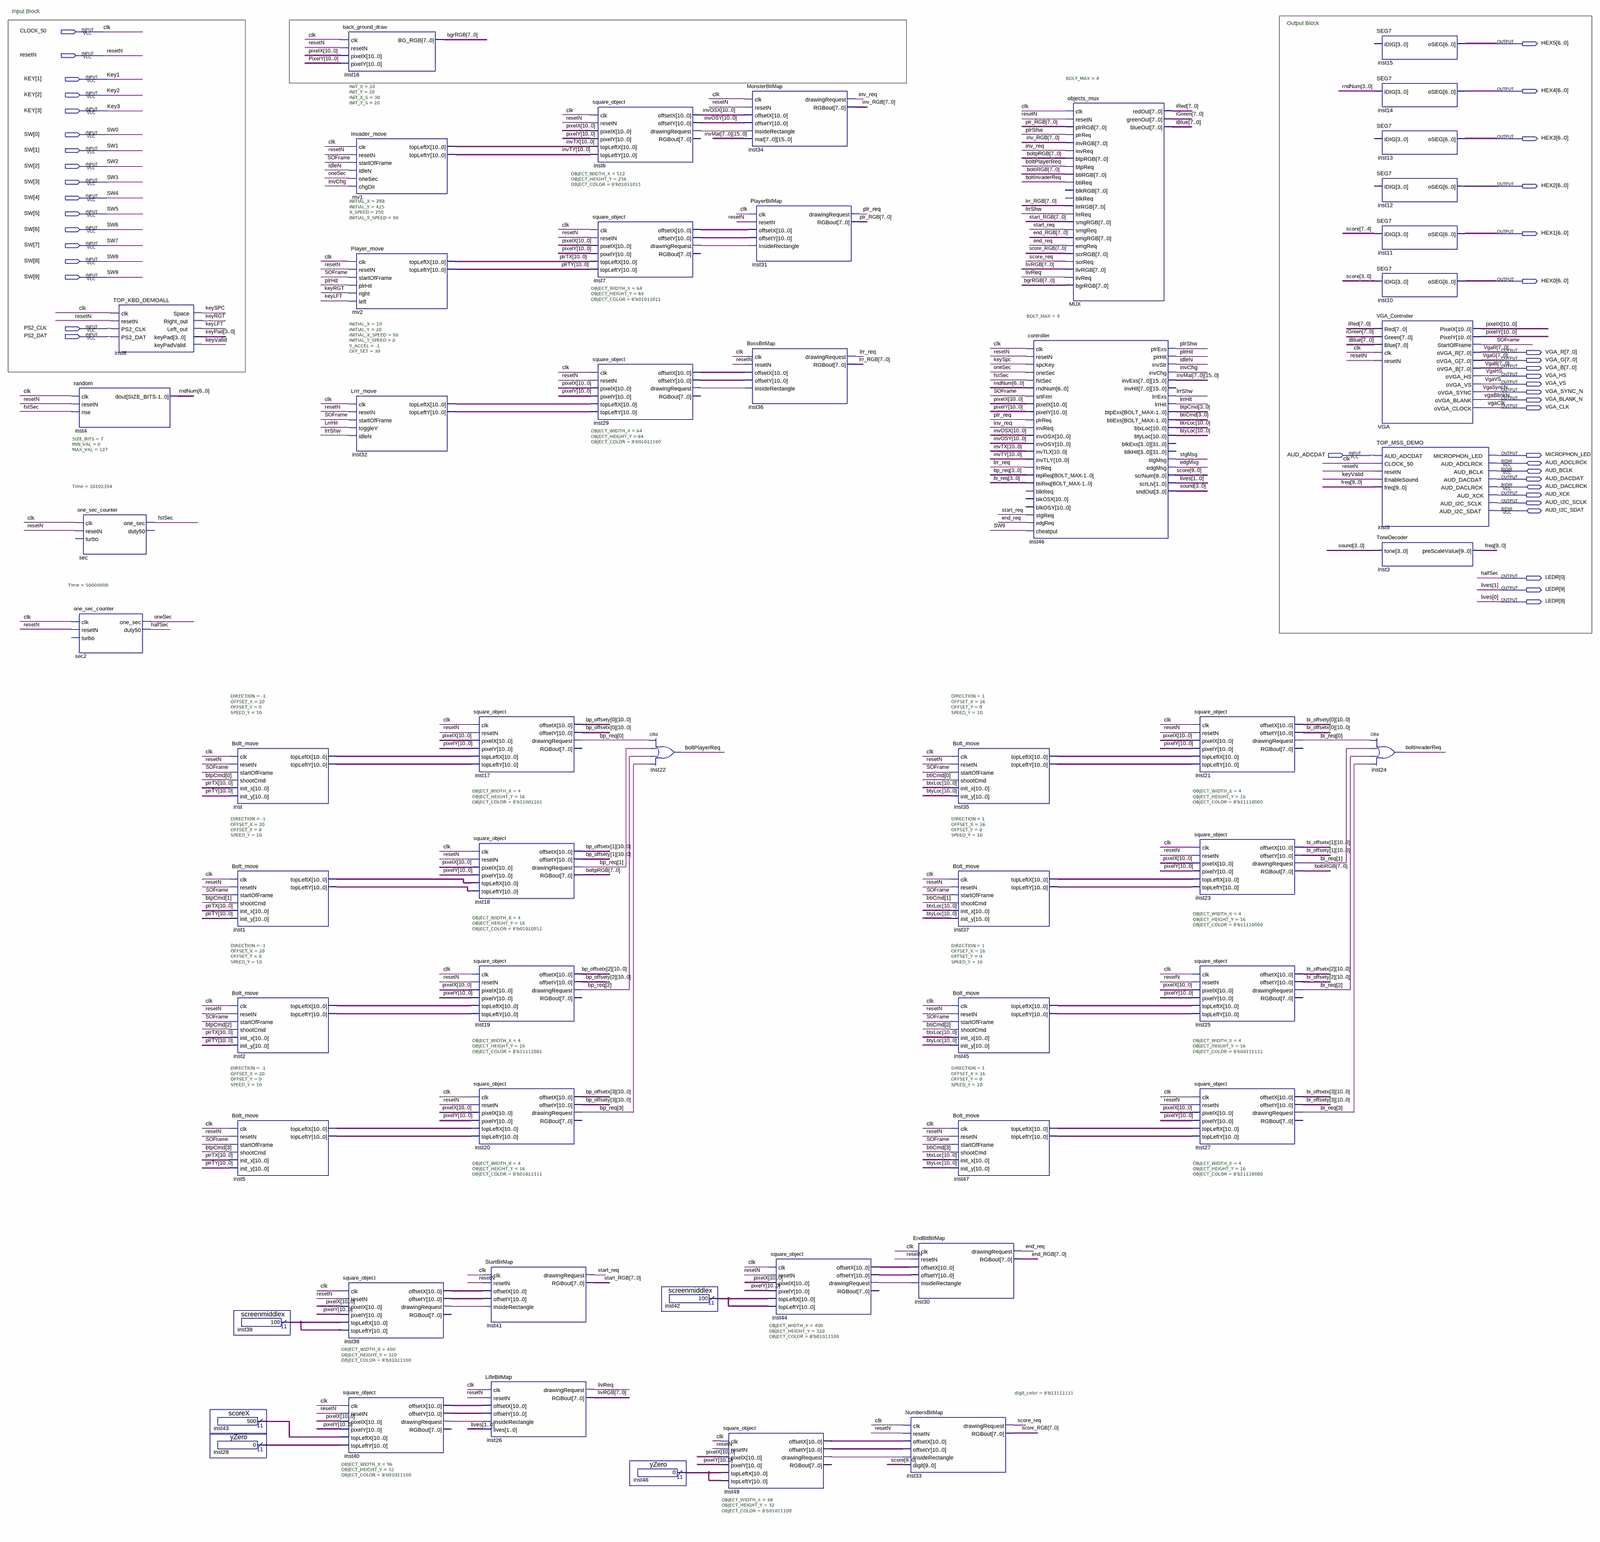
[diagram p0: schematic sheet, whole]
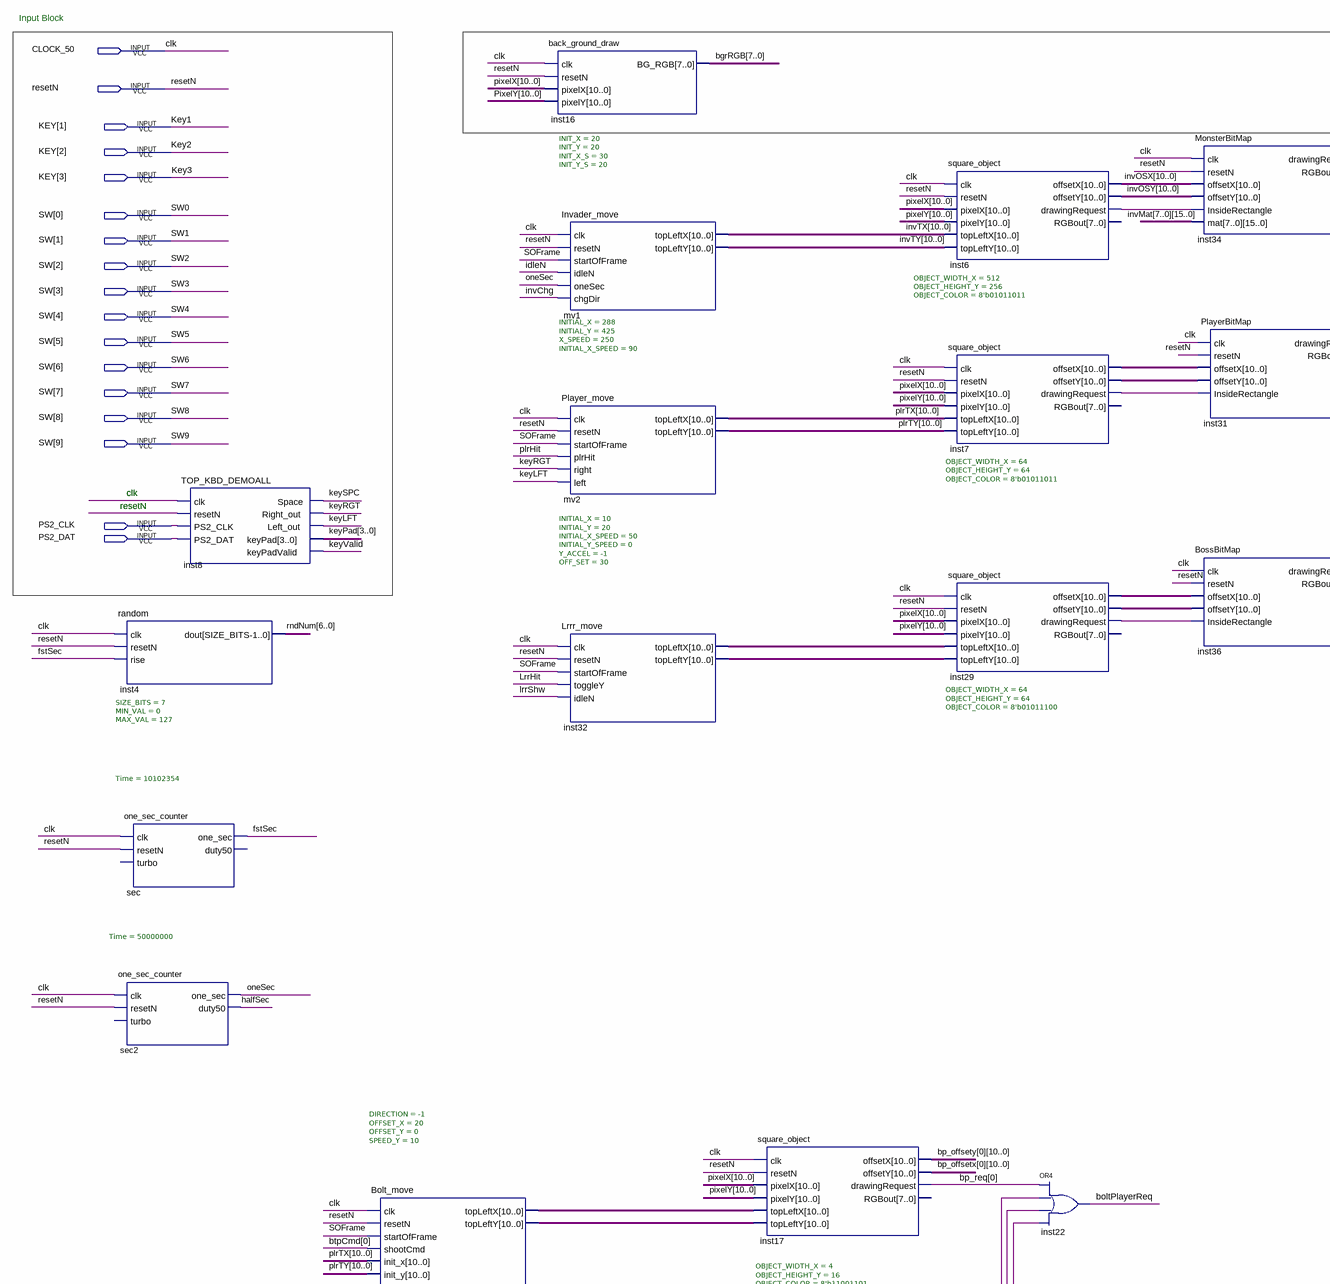
[diagram p1: schematic sheet, upper left part]
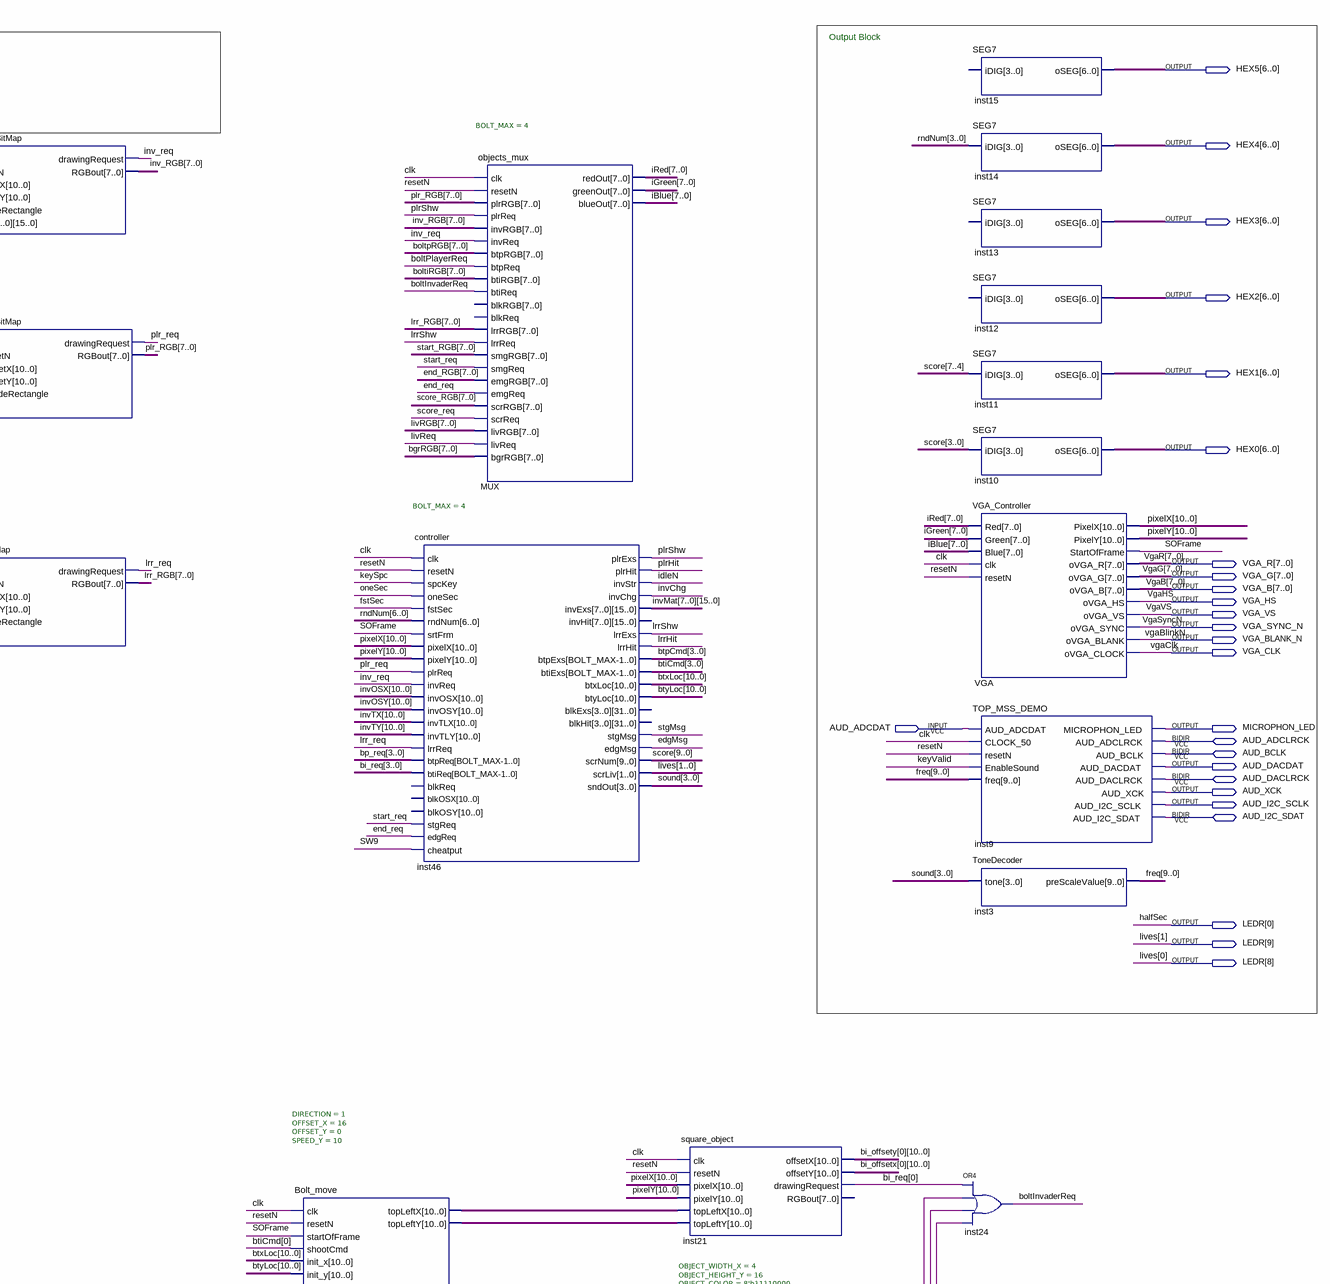
[diagram p2: schematic sheet, upper right part]
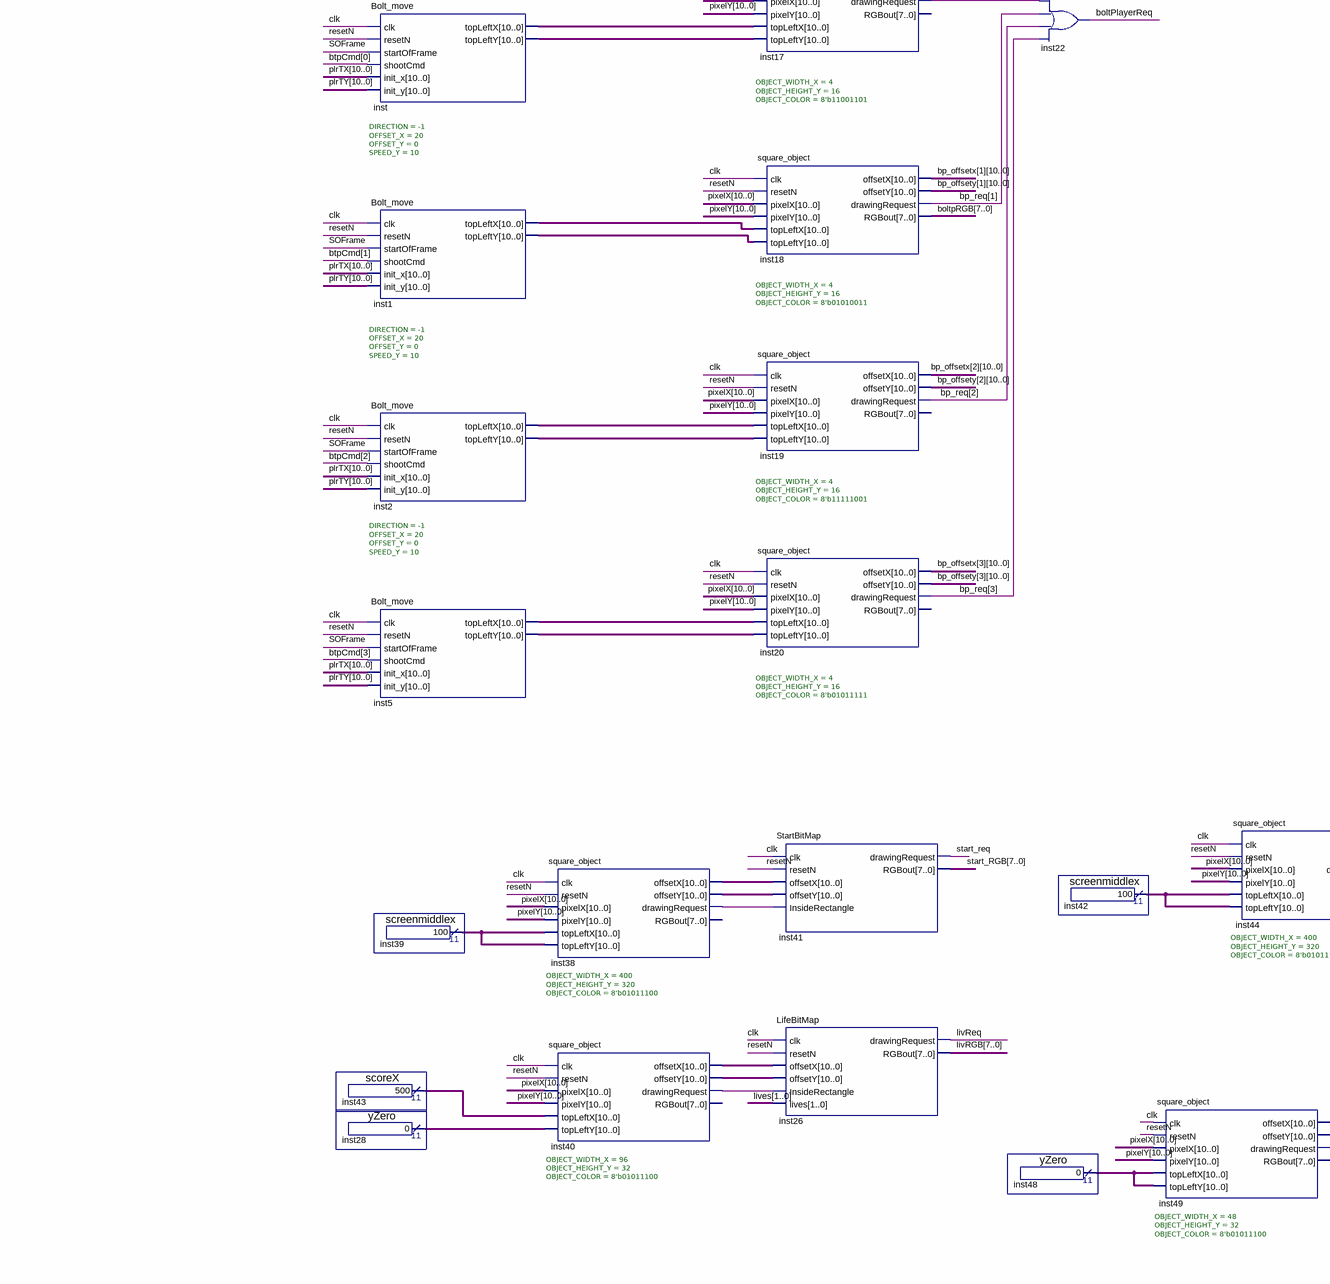
[diagram p3: schematic sheet, lower left part]
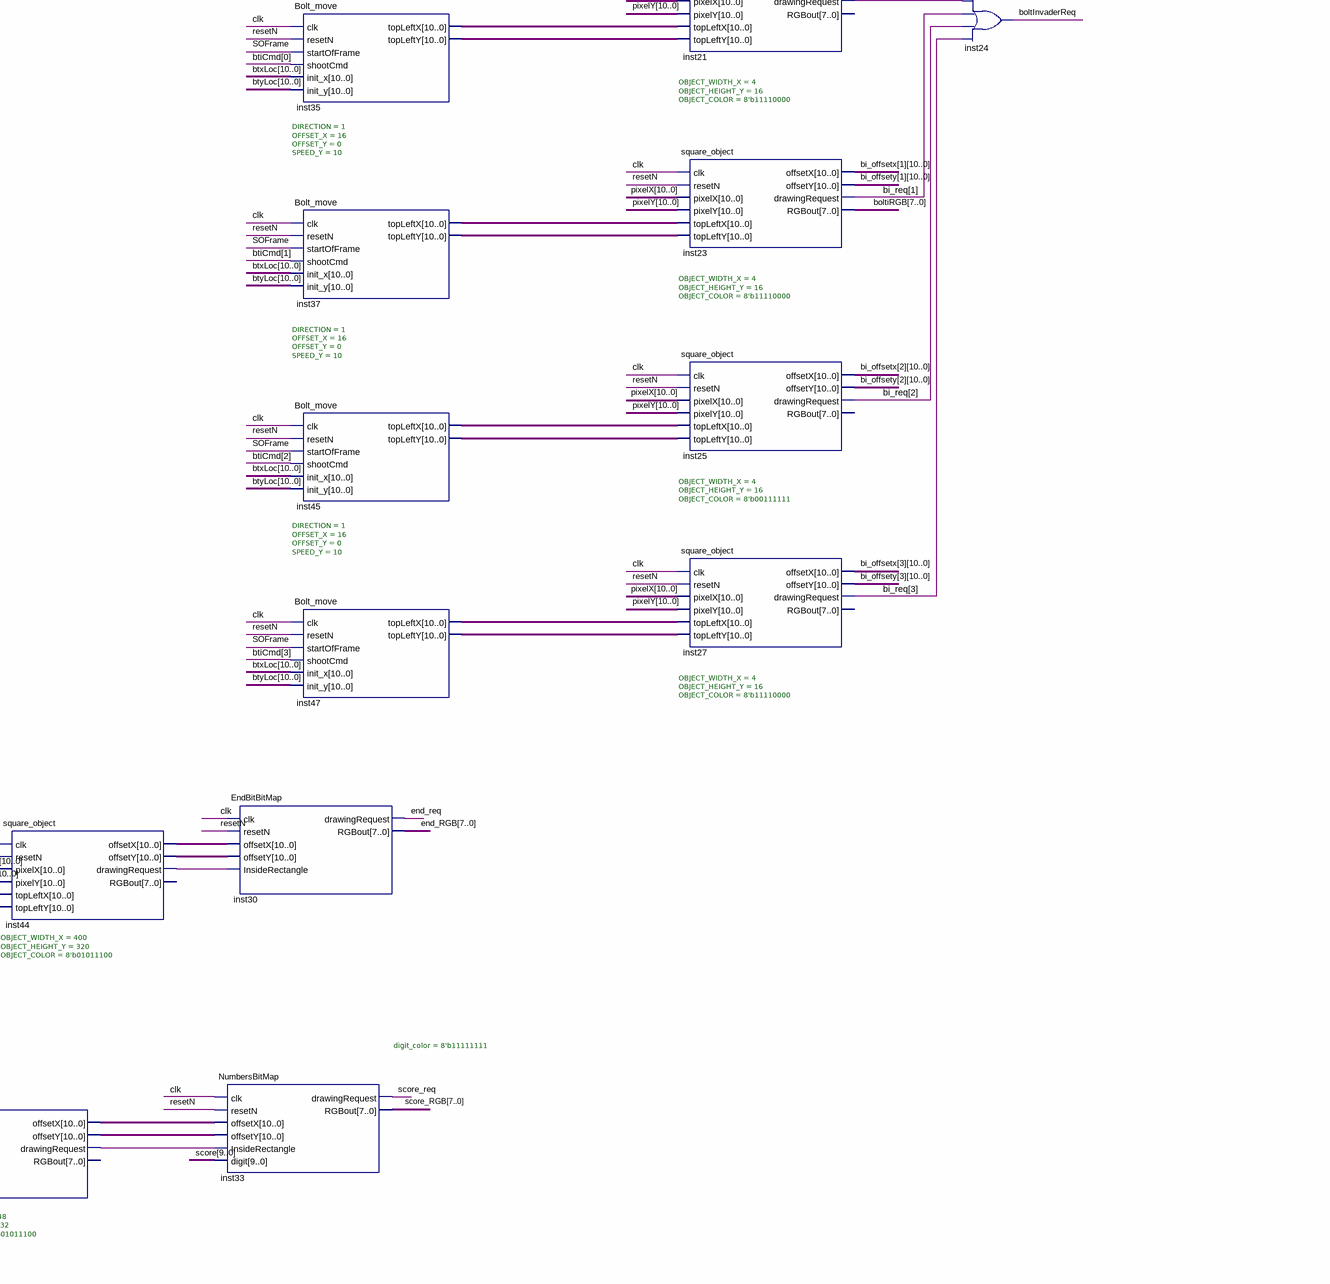
[diagram p4: schematic sheet, lower right part]
// Quartus schematic TOP_Schematic.bdf as structural Verilog: 56 symbols, 43 pins
module TOP_Schematic (
  input  CLOCK_50,
  input  resetN,
  input  [3:1] KEY,
  input  [9:0] SW,
  input  PS2_CLK,
  input  PS2_DAT,
  input  AUD_ADCDAT,
  inout  AUD_ADCLRCK,
  inout  AUD_BCLK,
  inout  AUD_DACLRCK,
  inout  AUD_I2C_SDAT,
  output [6:0] HEX5,
  output [6:0] HEX4,
  output [6:0] HEX3,
  output [6:0] HEX2,
  output [6:0] HEX1,
  output [6:0] HEX0,
  output [7:0] VGA_R,
  output [7:0] VGA_G,
  output [7:0] VGA_B,
  output VGA_HS,
  output VGA_VS,
  output VGA_SYNC_N,
  output VGA_BLANK_N,
  output VGA_CLK,
  output MICROPHON_LED,
  output AUD_DACDAT,
  output AUD_XCK,
  output AUD_I2C_SCLK,
  output [9:0] LEDR
);

  wire boltInvaderReq, boltPlayerReq, edgMsg, end_req, fstSec, idleN, inst6_drawingrequest,
       inst7_drawingrequest, inst29_drawingrequest, inst38_drawingrequest, inst40_drawingrequest,
       inst44_drawingrequest, inst49_drawingrequest, inv_req, invChg, keyLFT, keyRGT, keySPC, keyValid,
       livReq, lrr_req, lrrHit, lrrShw, oneSec, plr_req, plrHit, plrShw, score_req, SOFrame, start_req,
       stgMsg;
  wire [3:0] bi_req, bp_req, btiCmd, btpCmd, keyPad, sound;
  wire [6:0] rndNum;
  wire [7:0] bgrRGB, boltiRGB, boltpRGB, end_RGB, iBlue, iGreen, inv_RGB, iRed, livRGB, lrr_RGB, plr_RGB,
       score_RGB, start_RGB;
  wire [9:0] freq, score;
  wire [10:0] bi_offsetx_0, bi_offsetx_1, bi_offsetx_2, bi_offsetx_3, bi_offsety_0, bi_offsety_1,
       bi_offsety_2, bi_offsety_3, bp_offsetx_0, bp_offsetx_1, bp_offsetx_2, bp_offsetx_3, bp_offsety_0,
       bp_offsety_1, bp_offsety_2, bp_offsety_3, btxLoc, btyLoc, inst1_topleftx, inst1_toplefty,
       inst2_topleftx, inst2_toplefty, inst5_topleftx, inst5_toplefty, inst7_offsetx, inst7_offsety,
       inst28_result, inst29_offsetx, inst29_offsety, inst32_topleftx, inst32_toplefty, inst35_topleftx,
       inst35_toplefty, inst37_topleftx, inst37_toplefty, inst38_offsetx, inst38_offsety, inst39_result,
       inst40_offsetx, inst40_offsety, inst42_result, inst43_result, inst44_offsetx, inst44_offsety,
       inst45_topleftx, inst45_toplefty, inst47_topleftx, inst47_toplefty, inst48_result, inst49_offsetx,
       inst49_offsety, inst_topleftx, inst_toplefty, invOSX, invOSY, invTX, invTY, pixelX, PixelY, plrTX,
       plrTY;
  wire [15:0] invMat_0, invMat_1, invMat_2, invMat_3, invMat_4, invMat_5, invMat_6, invMat_7;

  random #(.SIZE_BITS(7), .MIN_VAL(0), .MAX_VAL(127)) inst4 (
    .clk(CLOCK_50), .resetN(resetN), .rise(fstSec), .dout(rndNum));
  one_sec_counter #(.Time(10102354)) sec (.clk(CLOCK_50), .resetN(resetN), .one_sec(fstSec));  // open: turbo, duty50
  one_sec_counter #(.Time(50000000)) sec2 (
    .clk(CLOCK_50), .resetN(resetN), .one_sec(oneSec), .duty50(LEDR[0]));  // open: turbo
  TOP_KBD_DEMOALL inst8 (
    .clk(CLOCK_50), .resetN(resetN), .PS2_CLK(PS2_CLK), .PS2_DAT(PS2_DAT), .Space(keySPC),
    .Right_out(keyRGT), .Left_out(keyLFT), .keyPad(keyPad), .keyPadValid(keyValid));
  Bolt_move #(.DIRECTION(-1), .OFFSET_X(20), .OFFSET_Y(0), .SPEED_Y(10)) inst (
    .clk(CLOCK_50), .resetN(resetN), .startOfFrame(SOFrame), .shootCmd(btpCmd[0]), .init_x(plrTX),
    .init_y(plrTY), .topLeftX(inst_topleftx), .topLeftY(inst_toplefty));
  Bolt_move #(.DIRECTION(-1), .OFFSET_X(20), .OFFSET_Y(0), .SPEED_Y(10)) inst1 (
    .clk(CLOCK_50), .resetN(resetN), .startOfFrame(SOFrame), .shootCmd(btpCmd[1]), .init_x(plrTX),
    .init_y(plrTY), .topLeftX(inst1_topleftx), .topLeftY(inst1_toplefty));
  Bolt_move #(.DIRECTION(-1), .OFFSET_X(20), .OFFSET_Y(0), .SPEED_Y(10)) inst2 (
    .clk(CLOCK_50), .resetN(resetN), .startOfFrame(SOFrame), .shootCmd(btpCmd[2]), .init_x(plrTX),
    .init_y(plrTY), .topLeftX(inst2_topleftx), .topLeftY(inst2_toplefty));
  Bolt_move #(.DIRECTION(-1), .OFFSET_X(20), .OFFSET_Y(0), .SPEED_Y(10)) inst5 (
    .clk(CLOCK_50), .resetN(resetN), .startOfFrame(SOFrame), .shootCmd(btpCmd[3]), .init_x(plrTX),
    .init_y(plrTY), .topLeftX(inst5_topleftx), .topLeftY(inst5_toplefty));
  screenmiddlex inst39 (.result(inst39_result));
  scoreX inst43 (.result(inst43_result));
  yZero inst28 (.result(inst28_result));
  back_ground_draw inst16 (.clk(CLOCK_50), .resetN(resetN), .pixelX(pixelX), .pixelY(PixelY), .BG_RGB(bgrRGB));
  Invader_move #(.INIT_X(20), .INIT_Y(20), .INIT_X_S(30), .INIT_Y_S(20)) mv1 (
    .clk(CLOCK_50), .resetN(resetN), .startOfFrame(SOFrame), .idleN(idleN), .oneSec(oneSec), .chgDir(invChg),
    .topLeftX(invTX), .topLeftY(invTY));
  Player_move #(.INITIAL_X(288), .INITIAL_Y(425), .X_SPEED(250), .INITIAL_X_SPEED(90)) mv2 (
    .clk(CLOCK_50), .resetN(resetN), .startOfFrame(SOFrame), .plrHit(plrHit), .right(keyRGT), .left(keyLFT),
    .topLeftX(plrTX), .topLeftY(plrTY));
  Lrrr_move #(.INITIAL_X(10), .INITIAL_Y(20), .INITIAL_X_SPEED(50), .INITIAL_Y_SPEED(0), .Y_ACCEL(-1), .OFF_SET(30)) inst32 (
    .clk(CLOCK_50), .resetN(resetN), .startOfFrame(SOFrame), .toggleY(lrrHit), .idleN(lrrShw),
    .topLeftX(inst32_topleftx), .topLeftY(inst32_toplefty));
  square_object #(.OBJECT_WIDTH_X(400), .OBJECT_HEIGHT_Y(320), .OBJECT_COLOR(8'b01011100)) inst38 (
    .clk(CLOCK_50), .resetN(resetN), .pixelX(pixelX), .pixelY(PixelY), .topLeftX(inst39_result),
    .topLeftY(inst39_result), .offsetX(inst38_offsetx), .offsetY(inst38_offsety),
    .drawingRequest(inst38_drawingrequest));  // open: RGBout
  square_object #(.OBJECT_WIDTH_X(96), .OBJECT_HEIGHT_Y(32), .OBJECT_COLOR(8'b01011100)) inst40 (
    .clk(CLOCK_50), .resetN(resetN), .pixelX(pixelX), .pixelY(PixelY), .topLeftX(inst43_result),
    .topLeftY(inst28_result), .offsetX(inst40_offsetx), .offsetY(inst40_offsety),
    .drawingRequest(inst40_drawingrequest));  // open: RGBout
  square_object #(.OBJECT_WIDTH_X(4), .OBJECT_HEIGHT_Y(16), .OBJECT_COLOR(8'b11001101)) inst17 (
    .clk(CLOCK_50), .resetN(resetN), .pixelX(pixelX), .pixelY(PixelY), .topLeftX(inst_topleftx),
    .topLeftY(inst_toplefty), .offsetX(bp_offsety_0), .offsetY(bp_offsetx_0), .drawingRequest(bp_req[0]));  // open: RGBout
  square_object #(.OBJECT_WIDTH_X(4), .OBJECT_HEIGHT_Y(16), .OBJECT_COLOR(8'b01010011)) inst18 (
    .clk(CLOCK_50), .resetN(resetN), .pixelX(pixelX), .pixelY(PixelY), .topLeftX(inst1_topleftx),
    .topLeftY(inst1_toplefty), .offsetX(bp_offsetx_1), .offsetY(bp_offsety_1), .drawingRequest(bp_req[1]),
    .RGBout(boltpRGB));
  square_object #(.OBJECT_WIDTH_X(4), .OBJECT_HEIGHT_Y(16), .OBJECT_COLOR(8'b11111001)) inst19 (
    .clk(CLOCK_50), .resetN(resetN), .pixelX(pixelX), .pixelY(PixelY), .topLeftX(inst2_topleftx),
    .topLeftY(inst2_toplefty), .offsetX(bp_offsetx_2), .offsetY(bp_offsety_2), .drawingRequest(bp_req[2]));  // open: RGBout
  square_object #(.OBJECT_WIDTH_X(4), .OBJECT_HEIGHT_Y(16), .OBJECT_COLOR(8'b01011111)) inst20 (
    .clk(CLOCK_50), .resetN(resetN), .pixelX(pixelX), .pixelY(PixelY), .topLeftX(inst5_topleftx),
    .topLeftY(inst5_toplefty), .offsetX(bp_offsetx_3), .offsetY(bp_offsety_3), .drawingRequest(bp_req[3]));  // open: RGBout
  StartBitMap inst41 (
    .clk(CLOCK_50), .resetN(resetN), .offsetX(inst38_offsetx), .offsetY(inst38_offsety),
    .InsideRectangle(inst38_drawingrequest), .drawingRequest(start_req), .RGBout(start_RGB));
  LifeBitMap inst26 (
    .clk(CLOCK_50), .resetN(resetN), .offsetX(inst40_offsetx), .offsetY(inst40_offsety),
    .InsideRectangle(inst40_drawingrequest), .lives(LEDR[9:8]), .drawingRequest(livReq), .RGBout(livRGB));
  square_object #(.OBJECT_WIDTH_X(512), .OBJECT_HEIGHT_Y(256), .OBJECT_COLOR(8'b01011011)) inst6 (
    .clk(CLOCK_50), .resetN(resetN), .pixelX(pixelX), .pixelY(PixelY), .topLeftX(invTX), .topLeftY(invTY),
    .offsetX(invOSX), .offsetY(invOSY), .drawingRequest(inst6_drawingrequest));  // open: RGBout
  square_object #(.OBJECT_WIDTH_X(64), .OBJECT_HEIGHT_Y(64), .OBJECT_COLOR(8'b01011011)) inst7 (
    .clk(CLOCK_50), .resetN(resetN), .pixelX(pixelX), .pixelY(PixelY), .topLeftX(plrTX), .topLeftY(plrTY),
    .offsetX(inst7_offsetx), .offsetY(inst7_offsety), .drawingRequest(inst7_drawingrequest));  // open: RGBout
  square_object #(.OBJECT_WIDTH_X(64), .OBJECT_HEIGHT_Y(64), .OBJECT_COLOR(8'b01011100)) inst29 (
    .clk(CLOCK_50), .resetN(resetN), .pixelX(pixelX), .pixelY(PixelY), .topLeftX(inst32_topleftx),
    .topLeftY(inst32_toplefty), .offsetX(inst29_offsetx), .offsetY(inst29_offsety),
    .drawingRequest(inst29_drawingrequest));  // open: RGBout
  yZero inst48 (.result(inst48_result));
  or inst22 (boltPlayerReq, bp_req[0], bp_req[1], bp_req[2], bp_req[3]);
  screenmiddlex inst42 (.result(inst42_result));
  square_object #(.OBJECT_WIDTH_X(48), .OBJECT_HEIGHT_Y(32), .OBJECT_COLOR(8'b01011100)) inst49 (
    .clk(CLOCK_50), .resetN(resetN), .pixelX(pixelX), .pixelY(PixelY), .topLeftX(inst48_result),
    .topLeftY(inst48_result), .offsetX(inst49_offsetx), .offsetY(inst49_offsety),
    .drawingRequest(inst49_drawingrequest));  // open: RGBout
  MonsterBitMap inst34 (
    .clk(CLOCK_50), .resetN(resetN), .offsetX(invOSX), .offsetY(invOSY),
    .InsideRectangle(inst6_drawingrequest),
    .mat({invMat_7, invMat_6, invMat_5, invMat_4, invMat_3, invMat_2, invMat_1, invMat_0}),
    .drawingRequest(inv_req), .RGBout(inv_RGB));
  PlayerBitMap inst31 (
    .clk(CLOCK_50), .resetN(resetN), .offsetX(inst7_offsetx), .offsetY(inst7_offsety),
    .InsideRectangle(inst7_drawingrequest), .drawingRequest(plr_req), .RGBout(plr_RGB));
  BossBitMap inst36 (
    .clk(CLOCK_50), .resetN(resetN), .offsetX(inst29_offsetx), .offsetY(inst29_offsety),
    .InsideRectangle(inst29_drawingrequest), .drawingRequest(lrr_req), .RGBout(lrr_RGB));
  square_object #(.OBJECT_WIDTH_X(400), .OBJECT_HEIGHT_Y(320), .OBJECT_COLOR(8'b01011100)) inst44 (
    .clk(CLOCK_50), .resetN(resetN), .pixelX(pixelX), .pixelY(PixelY), .topLeftX(inst42_result),
    .topLeftY(inst42_result), .offsetX(inst44_offsetx), .offsetY(inst44_offsety),
    .drawingRequest(inst44_drawingrequest));  // open: RGBout
  EndBitBitMap inst30 (
    .clk(CLOCK_50), .resetN(resetN), .offsetX(inst44_offsetx), .offsetY(inst44_offsety),
    .InsideRectangle(inst44_drawingrequest), .drawingRequest(end_req), .RGBout(end_RGB));
  NumbersBitMap #(.digit_color(8'b11111111)) inst33 (
    .clk(CLOCK_50), .resetN(resetN), .offsetX(inst49_offsetx), .offsetY(inst49_offsety),
    .InsideRectangle(inst49_drawingrequest), .digit(score), .drawingRequest(score_req), .RGBout(score_RGB));
  Bolt_move #(.DIRECTION(1), .OFFSET_X(16), .OFFSET_Y(0), .SPEED_Y(10)) inst35 (
    .clk(CLOCK_50), .resetN(resetN), .startOfFrame(SOFrame), .shootCmd(btiCmd[0]), .init_x(btxLoc),
    .init_y(btyLoc), .topLeftX(inst35_topleftx), .topLeftY(inst35_toplefty));
  Bolt_move #(.DIRECTION(1), .OFFSET_X(16), .OFFSET_Y(0), .SPEED_Y(10)) inst37 (
    .clk(CLOCK_50), .resetN(resetN), .startOfFrame(SOFrame), .shootCmd(btiCmd[1]), .init_x(btxLoc),
    .init_y(btyLoc), .topLeftX(inst37_topleftx), .topLeftY(inst37_toplefty));
  Bolt_move #(.DIRECTION(1), .OFFSET_X(16), .OFFSET_Y(0), .SPEED_Y(10)) inst45 (
    .clk(CLOCK_50), .resetN(resetN), .startOfFrame(SOFrame), .shootCmd(btiCmd[2]), .init_x(btxLoc),
    .init_y(btyLoc), .topLeftX(inst45_topleftx), .topLeftY(inst45_toplefty));
  Bolt_move #(.DIRECTION(1), .OFFSET_X(16), .OFFSET_Y(0), .SPEED_Y(10)) inst47 (
    .clk(CLOCK_50), .resetN(resetN), .startOfFrame(SOFrame), .shootCmd(btiCmd[3]), .init_x(btxLoc),
    .init_y(btyLoc), .topLeftX(inst47_topleftx), .topLeftY(inst47_toplefty));
  controller #(.BOLT_MAX(4)) inst46 (
    .clk(CLOCK_50), .resetN(resetN), .spcKey(keySPC), .oneSec(oneSec), .fstSec(fstSec), .rndNum(rndNum),
    .srtFrm(SOFrame), .pixelX(pixelX), .pixelY(PixelY), .plrReq(plr_req), .invReq(inv_req), .invOSX(invOSX),
    .invOSY(invOSY), .invTLX(invTX), .invTLY(invTY), .lrrReq(lrr_req), .btpReq(bp_req), .btiReq(bi_req),
    .stgReq(start_req), .edgReq(end_req), .cheatput(SW[9]), .plrExs(plrShw), .plrHit(plrHit), .invStr(idleN),
    .invChg(invChg),
    .invExs({invMat_7, invMat_6, invMat_5, invMat_4, invMat_3, invMat_2, invMat_1, invMat_0}),
    .lrrExs(lrrShw), .lrrHit(lrrHit), .btpExs(btpCmd), .btiExs(btiCmd), .btxLoc(btxLoc), .btyLoc(btyLoc),
    .stgMsg(stgMsg), .edgMsg(edgMsg), .scrNum(score), .scrLiv(LEDR[9:8]), .sndOut(sound));  // open: blkReq, blkOSX, blkOSY, invHit, blkExs, blkHit
  objects_mux #(.BOLT_MAX(4)) MUX (
    .clk(CLOCK_50), .resetN(resetN), .plrRGB(plr_RGB), .plrReq(plrShw), .invRGB(inv_RGB), .invReq(inv_req),
    .btpRGB(boltpRGB), .btpReq(boltPlayerReq), .btiRGB(boltiRGB), .btiReq(boltInvaderReq), .lrrRGB(lrr_RGB),
    .lrrReq(lrrShw), .smgRGB(start_RGB), .smgReq(start_req), .emgRGB(end_RGB), .emgReq(end_req),
    .scrRGB(score_RGB), .scrReq(score_req), .livRGB(livRGB), .livReq(livReq), .bgrRGB(bgrRGB), .redOut(iRed),
    .greenOut(iGreen), .blueOut(iBlue));  // open: blkRGB, blkReq
  square_object #(.OBJECT_WIDTH_X(4), .OBJECT_HEIGHT_Y(16), .OBJECT_COLOR(8'b11110000)) inst21 (
    .clk(CLOCK_50), .resetN(resetN), .pixelX(pixelX), .pixelY(PixelY), .topLeftX(inst35_topleftx),
    .topLeftY(inst35_toplefty), .offsetX(bi_offsety_0), .offsetY(bi_offsetx_0), .drawingRequest(bi_req[0]));  // open: RGBout
  square_object #(.OBJECT_WIDTH_X(4), .OBJECT_HEIGHT_Y(16), .OBJECT_COLOR(8'b11110000)) inst23 (
    .clk(CLOCK_50), .resetN(resetN), .pixelX(pixelX), .pixelY(PixelY), .topLeftX(inst37_topleftx),
    .topLeftY(inst37_toplefty), .offsetX(bi_offsetx_1), .offsetY(bi_offsety_1), .drawingRequest(bi_req[1]),
    .RGBout(boltiRGB));
  square_object #(.OBJECT_WIDTH_X(4), .OBJECT_HEIGHT_Y(16), .OBJECT_COLOR(8'b00111111)) inst25 (
    .clk(CLOCK_50), .resetN(resetN), .pixelX(pixelX), .pixelY(PixelY), .topLeftX(inst45_topleftx),
    .topLeftY(inst45_toplefty), .offsetX(bi_offsetx_2), .offsetY(bi_offsety_2), .drawingRequest(bi_req[2]));  // open: RGBout
  square_object #(.OBJECT_WIDTH_X(4), .OBJECT_HEIGHT_Y(16), .OBJECT_COLOR(8'b11110000)) inst27 (
    .clk(CLOCK_50), .resetN(resetN), .pixelX(pixelX), .pixelY(PixelY), .topLeftX(inst47_topleftx),
    .topLeftY(inst47_toplefty), .offsetX(bi_offsetx_3), .offsetY(bi_offsety_3), .drawingRequest(bi_req[3]));  // open: RGBout
  SEG7 inst15 (.oSEG(HEX5));  // open: iDIG
  SEG7 inst14 (.iDIG(rndNum[3:0]), .oSEG(HEX4));
  SEG7 inst13 (.oSEG(HEX3));  // open: iDIG
  SEG7 inst12 (.oSEG(HEX2));  // open: iDIG
  SEG7 inst11 (.iDIG(score[7:4]), .oSEG(HEX1));
  SEG7 inst10 (.iDIG(score[3:0]), .oSEG(HEX0));
  VGA_Controller VGA (
    .Red(iRed), .Green(iGreen), .Blue(iBlue), .clk(CLOCK_50), .resetN(resetN), .PixelX(pixelX),
    .PixelY(PixelY), .StartOfFrame(SOFrame), .oVGA_R(VGA_R), .oVGA_G(VGA_G), .oVGA_B(VGA_B),
    .oVGA_HS(VGA_HS), .oVGA_VS(VGA_VS), .oVGA_SYNC(VGA_SYNC_N), .oVGA_BLANK(VGA_BLANK_N), .oVGA_CLOCK(VGA_CLK));
  TOP_MSS_DEMO inst9 (
    .AUD_ADCDAT(AUD_ADCDAT), .CLOCK_50(CLOCK_50), .resetN(resetN), .EnableSound(keyValid), .freq(freq),
    .MICROPHON_LED(MICROPHON_LED), .AUD_DACDAT(AUD_DACDAT), .AUD_XCK(AUD_XCK), .AUD_I2C_SCLK(AUD_I2C_SCLK),
    .AUD_ADCLRCK(AUD_ADCLRCK), .AUD_BCLK(AUD_BCLK), .AUD_DACLRCK(AUD_DACLRCK), .AUD_I2C_SDAT(AUD_I2C_SDAT));
  ToneDecoder inst3 (.tone(sound), .preScaleValue(freq));
  or inst24 (boltInvaderReq, bi_req[0], bi_req[1], bi_req[2], bi_req[3]);

  // Other names for the same wires on the sheet: clk = CLOCK_50; halfSec = LEDR[0]; lives[1:0] = LEDR[9:8];
  //   VgaB[7:0] = VGA_B; vgaBlinkN = VGA_BLANK_N; vgaClk = VGA_CLK; VgaG[7:0] = VGA_G; VgaHS = VGA_HS;
  //   VgaR[7:0] = VGA_R; VgaSyncN = VGA_SYNC_N; VgaVS = VGA_VS

  // Notes on the sheet:
  //   Input Block
  //   Output Block
  //   clk
  //   resetN
endmodule
